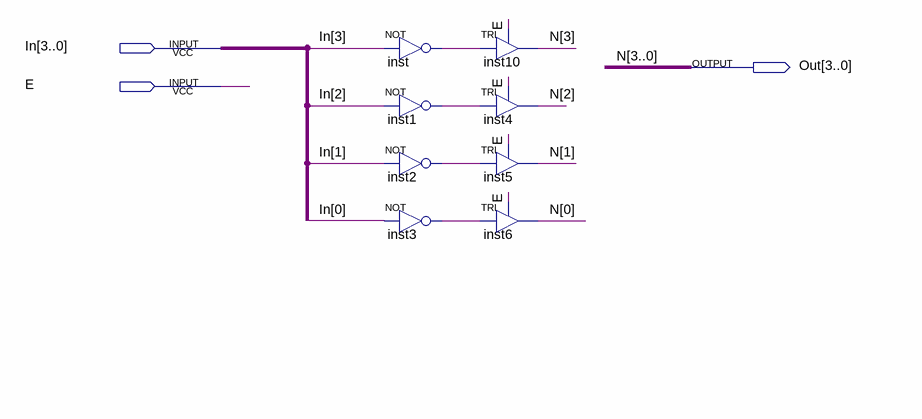
[diagram p0: schematic sheet]
// Quartus schematic Not4Bits.bdf as structural Verilog: 8 symbols, 3 pins
module Not4Bits (
  input  [3:0] In,
  input  E,
  output [3:0] Out
);

  wire inst1_out, inst2_out, inst3_out, inst_out;

  not inst (inst_out, In[3]);
  not inst1 (inst1_out, In[2]);
  not inst2 (inst2_out, In[1]);
  not inst3 (inst3_out, In[0]);
  TRI inst10 (.IN(inst_out), .OE(E), .OUT(Out[3]));
  TRI inst4 (.IN(inst1_out), .OE(E), .OUT(Out[2]));
  TRI inst5 (.IN(inst2_out), .OE(E), .OUT(Out[1]));
  TRI inst6 (.IN(inst3_out), .OE(E), .OUT(Out[0]));

  // Other names for the same wires on the sheet: N[3:0] = Out
endmodule
